# Altium schematic sheet buck2.SchDoc
size A4
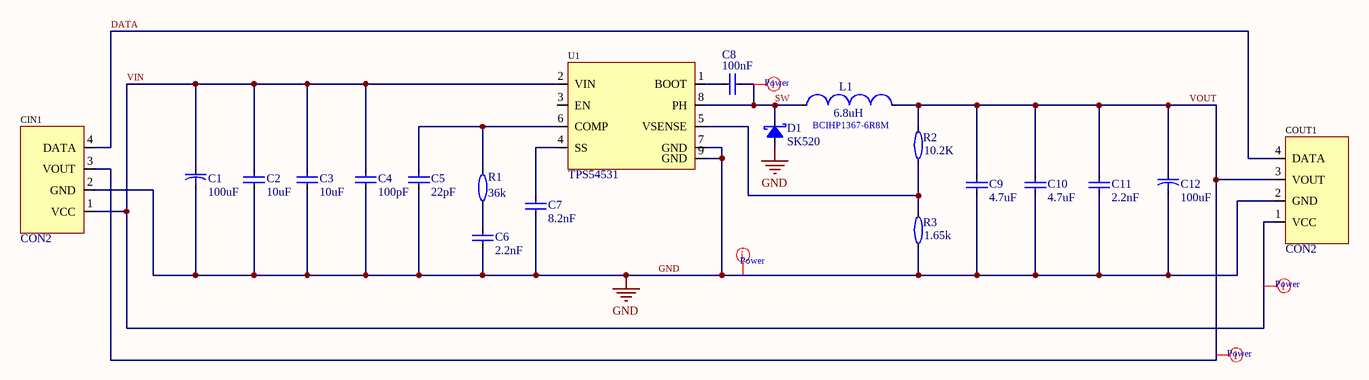
[diagram p0: buck2.SchDoc]

## Parts
C1  value 100uF  [CAPAE10083X104N]  (hidden comment: Cap2)
C2  value 10uF  [CAPC_1206_3216X16L]  (hidden comment: Cap)
C3  value 10uF  [CAPC_1206_3216X16L]  (hidden comment: Cap)
C4  value 100pF  [CAPC_0603_1608X08L]  (hidden comment: Cap)
C5  value 22pF  [CAPC_0603_1608X08L]  (hidden comment: Cap)
C6  value 2.2nF  [CAPC_0603_1608X08L]  (hidden comment: Cap)
C7  value 8.2nF  [CAPC_0603_1608X08L]  (hidden comment: Cap)
C8  value 100nF  [CAPC_0603_1608X08L]  (hidden comment: Cap)
C9  value 4.7uF  [CAPC_1206_3216X16L]  (hidden comment: Cap)
C10  value 4.7uF  [CAPC_1206_3216X16L]  (hidden comment: Cap)
C11  value 2.2nF  [CAPC_0603_1608X08L]  (hidden comment: Cap)
C12  value 100uF  [CAPAE10083X104N]  (hidden comment: Cap2)
CIN1  CON2  [CONNECTOR]
COUT1  CON2  [CONNECTOR]
D1  SK520  [CDBC-G]
L1  value 6.8uH  Part: BCIHP1367-6R8M  [INDP130128X70N]  (hidden comment: Inductor)
R1  value 36k  [RESC_0603_1608X08L]  (hidden comment: Res2)
R2  value 10.2K  [RESC_0603_1608X08L]  (hidden comment: Res2)
R3  value 1.65k  [RESC_0603_1608X08L]  (hidden comment: Res2)
U1  TPS54531  [SOIC127P600X150_HS-9L]

## Nets
GND: C1.2 C2.1 C3.1 C4.1 C5.1 C6.1 C7.1 C9.2 C10.2 C11.2 C12.2 CIN1.2(GND) COUT1.2(GND) D1.1(A) R3.1 U1.7(GND) U1.9(GND)
DATA: CIN1.4(DATA) COUT1.4(DATA)
SW: C8.1 D1.2(K) L1.1 U1.8(PH)
VIN: C1.1 C2.2 C3.2 C4.2 CIN1.1(VCC) COUT1.1(VCC) U1.2(VIN)
VOUT: C9.1 C10.1 C11.1 C12.1 CIN1.3(VOUT) COUT1.3(VOUT) L1.2 R2.2
NetC5_2: C5.2 R1.2 U1.6(COMP)
NetC6_2: C6.2 R1.1
NetC7_2: C7.2 U1.4(SS)
NetC8_2: C8.2 U1.1(BOOT)
NetR2_1: R2.1 R3.2 U1.5(VSENSE)

Not connected (* = marked no-connect by the designer): U1 3(EN)

## Layout directives
net class Power: GND, SW, VIN, VOUT

## Library data of the parts
C1 C12 = Cap2: Capacitor; Published: 23-Sep-2002; PackageReference: CAPR5-4X5; Publisher: Altium Limited; PackageDescription: Capacitor; 2 Leads
C2-C11 = Cap: Capacitor; Published: 8-Jun-2000; LatestRevisionDate: 17-Jul-2002; LatestRevisionNote: Re-released for DXP Platform.; PackageReference: RAD-0.3; Publisher: Altium Limited; PackageDescription: Radial Cap, Thru-Hole; 2 Leads; 0.3 in Pin Spacing
D1 = D Schottky: Schottky Diode; Published: 8-Jun-2000; LatestRevisionDate: 17-Jul-2002; LatestRevisionNote: Re-released for DXP Platform.; PackageReference: SMB; Publisher: Altium Limited; PackageDescription: DO-214-AA/SMB; 2 C-Bend Leads; Body 5.3 x 3.6 mm, inc. leads (LxW); Code_JEDEC: DO-214-AA
L1 = Inductor: Code_IEC: 1005; Published: 8-Jun-2000; LatestRevisionDate: 29-May-2009; LatestRevisionNote: IPC-7351 Footprint Added.; PackageReference: 0402-A; Publisher: Altium Limited; PackageDescription: Chip Inductor; Code_JEITA: 0402
R1-R3 = Res2: Resistor; Published: 8-Jun-2000; LatestRevisionDate: 17-Jul-2002; LatestRevisionNote: Re-released for DXP Platform.; PackageReference: AXIAL-0.4; Publisher: Altium Limited; PackageDescription: Axial Device, Thru-Hole; 2 Leads; 0.4 in Pin Spacing